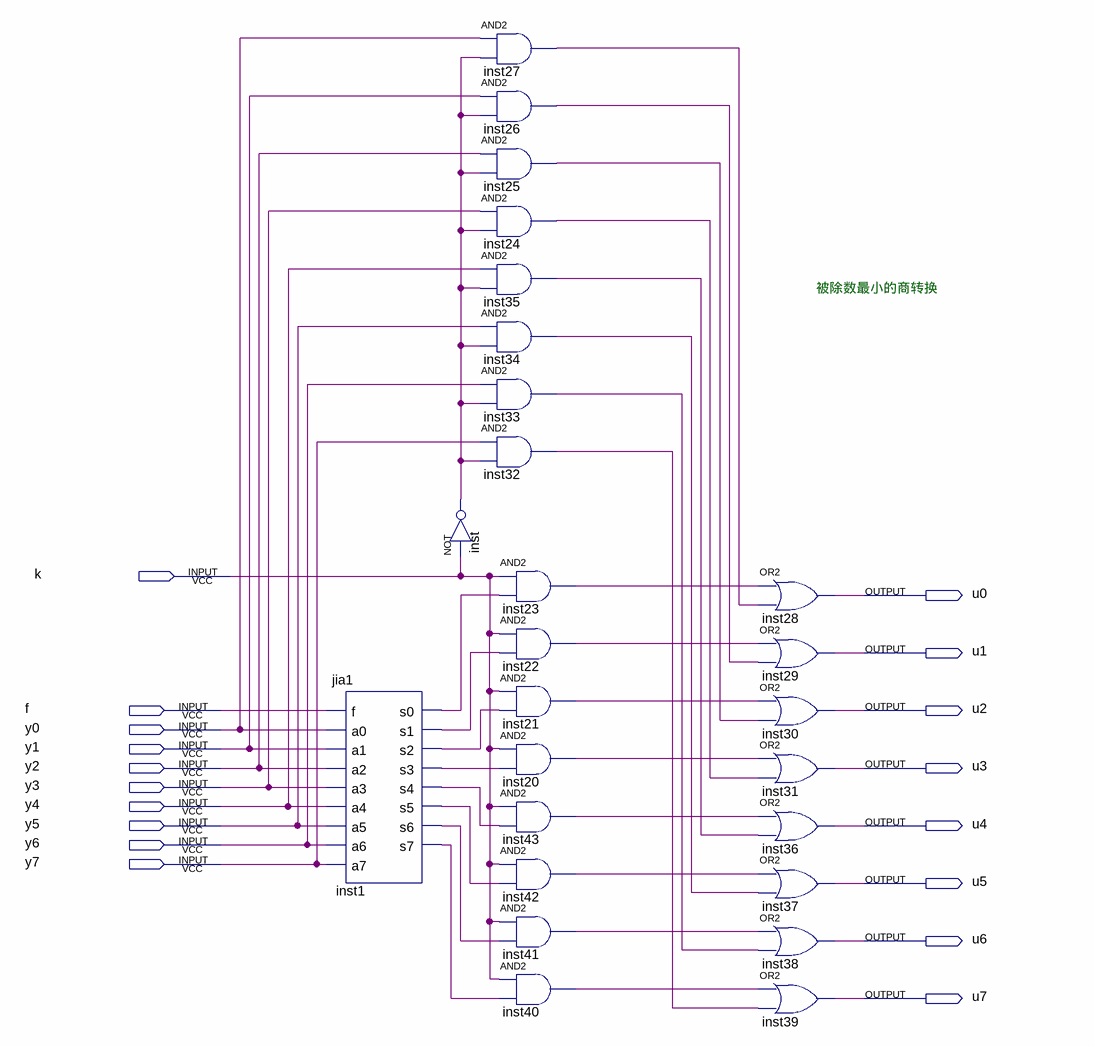
[diagram p0: schematic sheet]
// Quartus schematic zhbcsh.bdf as structural Verilog: 26 symbols, 18 pins
module zhbcsh (
  input  k,
  input  f,
  input  y0,
  input  y1,
  input  y2,
  input  y3,
  input  y4,
  input  y5,
  input  y6,
  input  y7,
  output u0,
  output u1,
  output u2,
  output u3,
  output u4,
  output u5,
  output u6,
  output u7
);

  wire inst1_s0, inst1_s1, inst1_s2, inst1_s3, inst1_s4, inst1_s5, inst1_s6, inst1_s7, inst20_out,
       inst21_out, inst22_out, inst23_out, inst24_out, inst25_out, inst26_out, inst27_out, inst32_out,
       inst33_out, inst34_out, inst35_out, inst40_out, inst41_out, inst42_out, inst43_out, inst_out;

  jia1 inst1 (
    .f(f), .a0(y0), .a1(y1), .a2(y2), .a3(y3), .a4(y4), .a5(y5), .a6(y6), .a7(y7), .s0(inst1_s0),
    .s1(inst1_s1), .s2(inst1_s2), .s3(inst1_s3), .s4(inst1_s4), .s5(inst1_s5), .s6(inst1_s6), .s7(inst1_s7));
  not inst (inst_out, k);
  and inst27 (inst27_out, y0, inst_out);
  and inst26 (inst26_out, y1, inst_out);
  and inst25 (inst25_out, y2, inst_out);
  and inst24 (inst24_out, y3, inst_out);
  and inst35 (inst35_out, y4, inst_out);
  and inst34 (inst34_out, y5, inst_out);
  and inst33 (inst33_out, y6, inst_out);
  and inst32 (inst32_out, y7, inst_out);
  and inst23 (inst23_out, k, inst1_s0);
  and inst22 (inst22_out, k, inst1_s1);
  and inst21 (inst21_out, k, inst1_s2);
  and inst20 (inst20_out, k, inst1_s3);
  and inst43 (inst43_out, k, inst1_s4);
  and inst42 (inst42_out, k, inst1_s5);
  and inst41 (inst41_out, k, inst1_s6);
  and inst40 (inst40_out, k, inst1_s7);
  or inst28 (u0, inst23_out, inst27_out);
  or inst29 (u1, inst22_out, inst26_out);
  or inst30 (u2, inst21_out, inst25_out);
  or inst31 (u3, inst20_out, inst24_out);
  or inst36 (u4, inst43_out, inst35_out);
  or inst37 (u5, inst42_out, inst34_out);
  or inst38 (u6, inst41_out, inst33_out);
  or inst39 (u7, inst40_out, inst32_out);

  // Notes on the sheet:
  //   被除数最小的商转换
endmodule
